# Altium schematic sheet S7CAS-PLEIADES-CARTE-MERE_P06_MOTOR.SCHDOC
size Tabloid; SheetNumber: 13; SheetTotal: 18; Sheet_Name: MOTOR; Size: 11x17
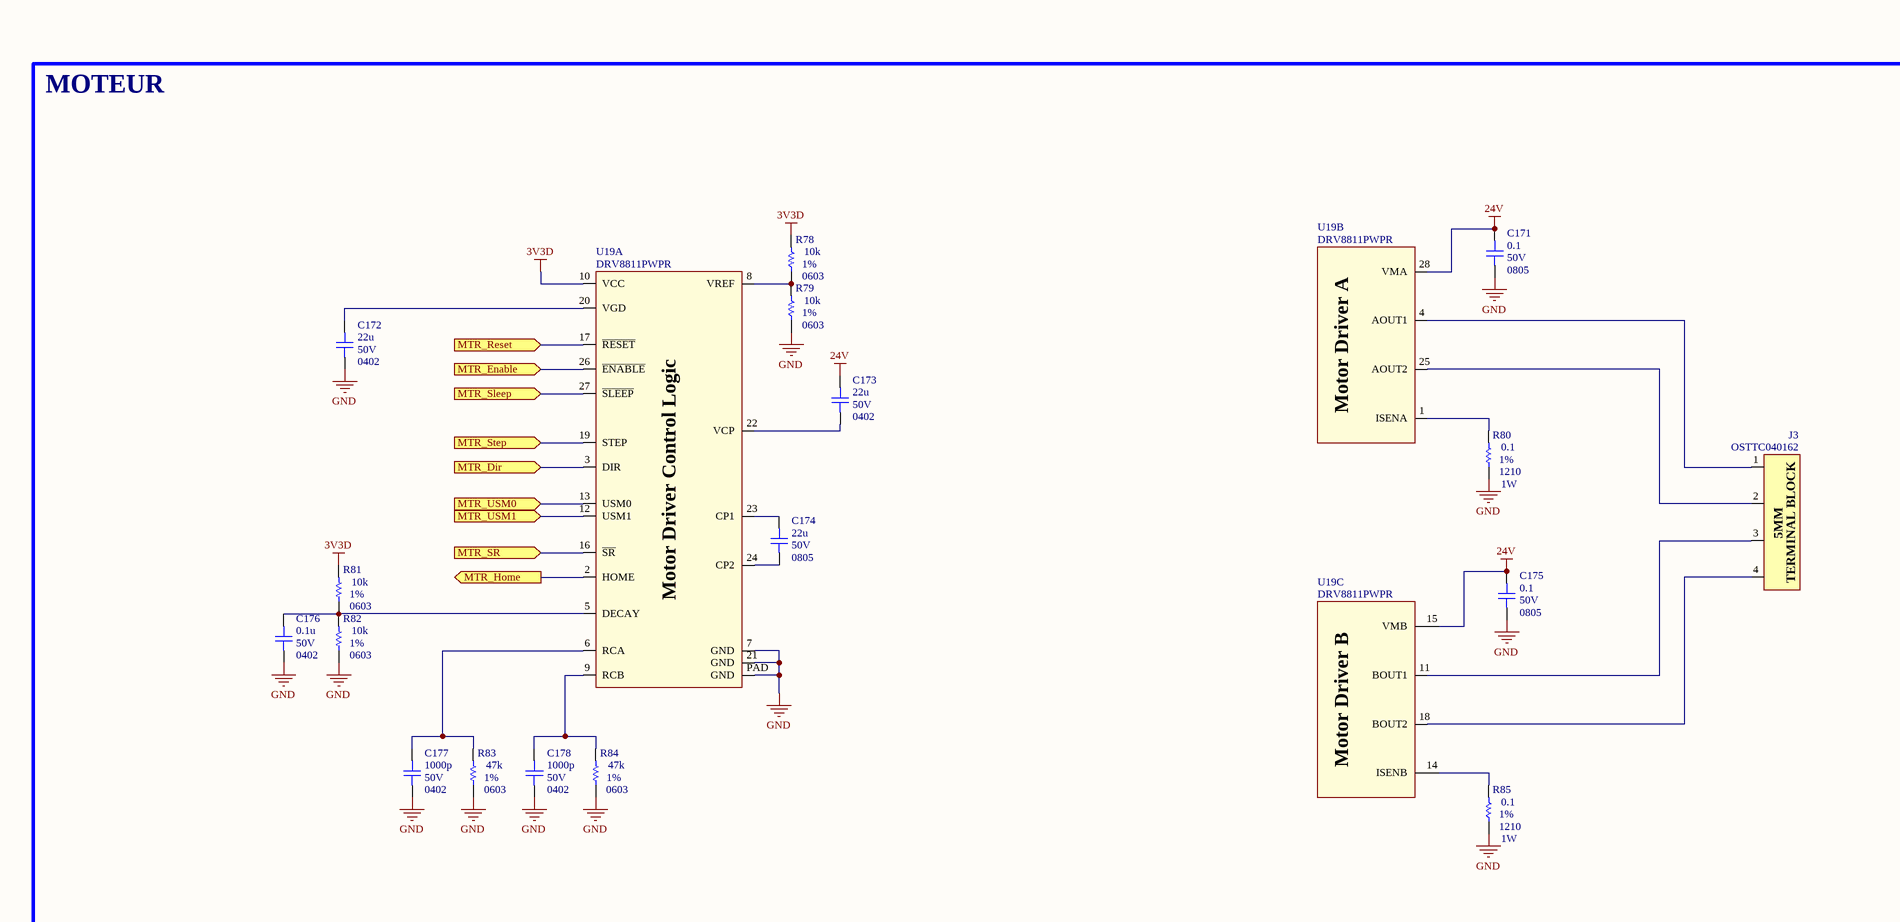
[diagram p0: S7CAS-PLEIADES-CARTE-MERE_P06_MOTOR.SCHDOC, top left]
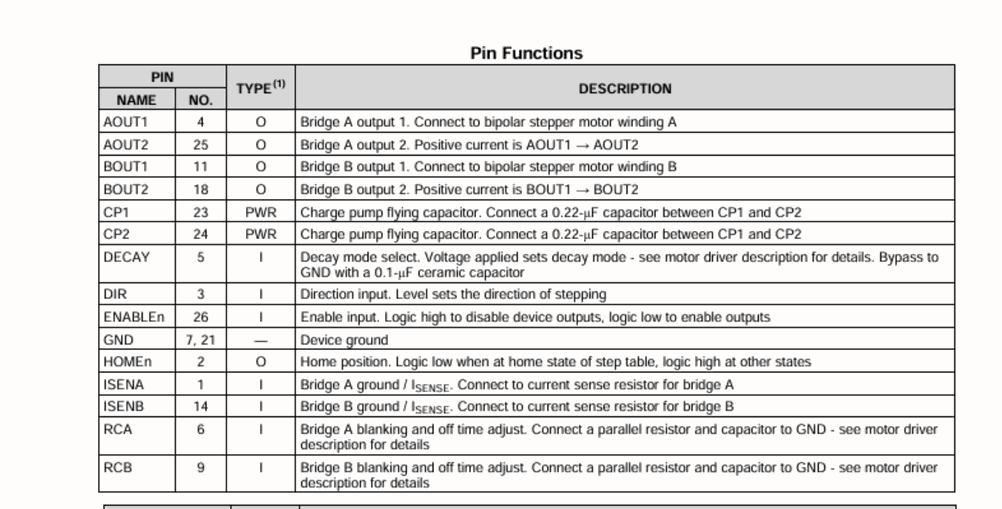
[diagram p1: S7CAS-PLEIADES-CARTE-MERE_P06_MOTOR.SCHDOC, top right]
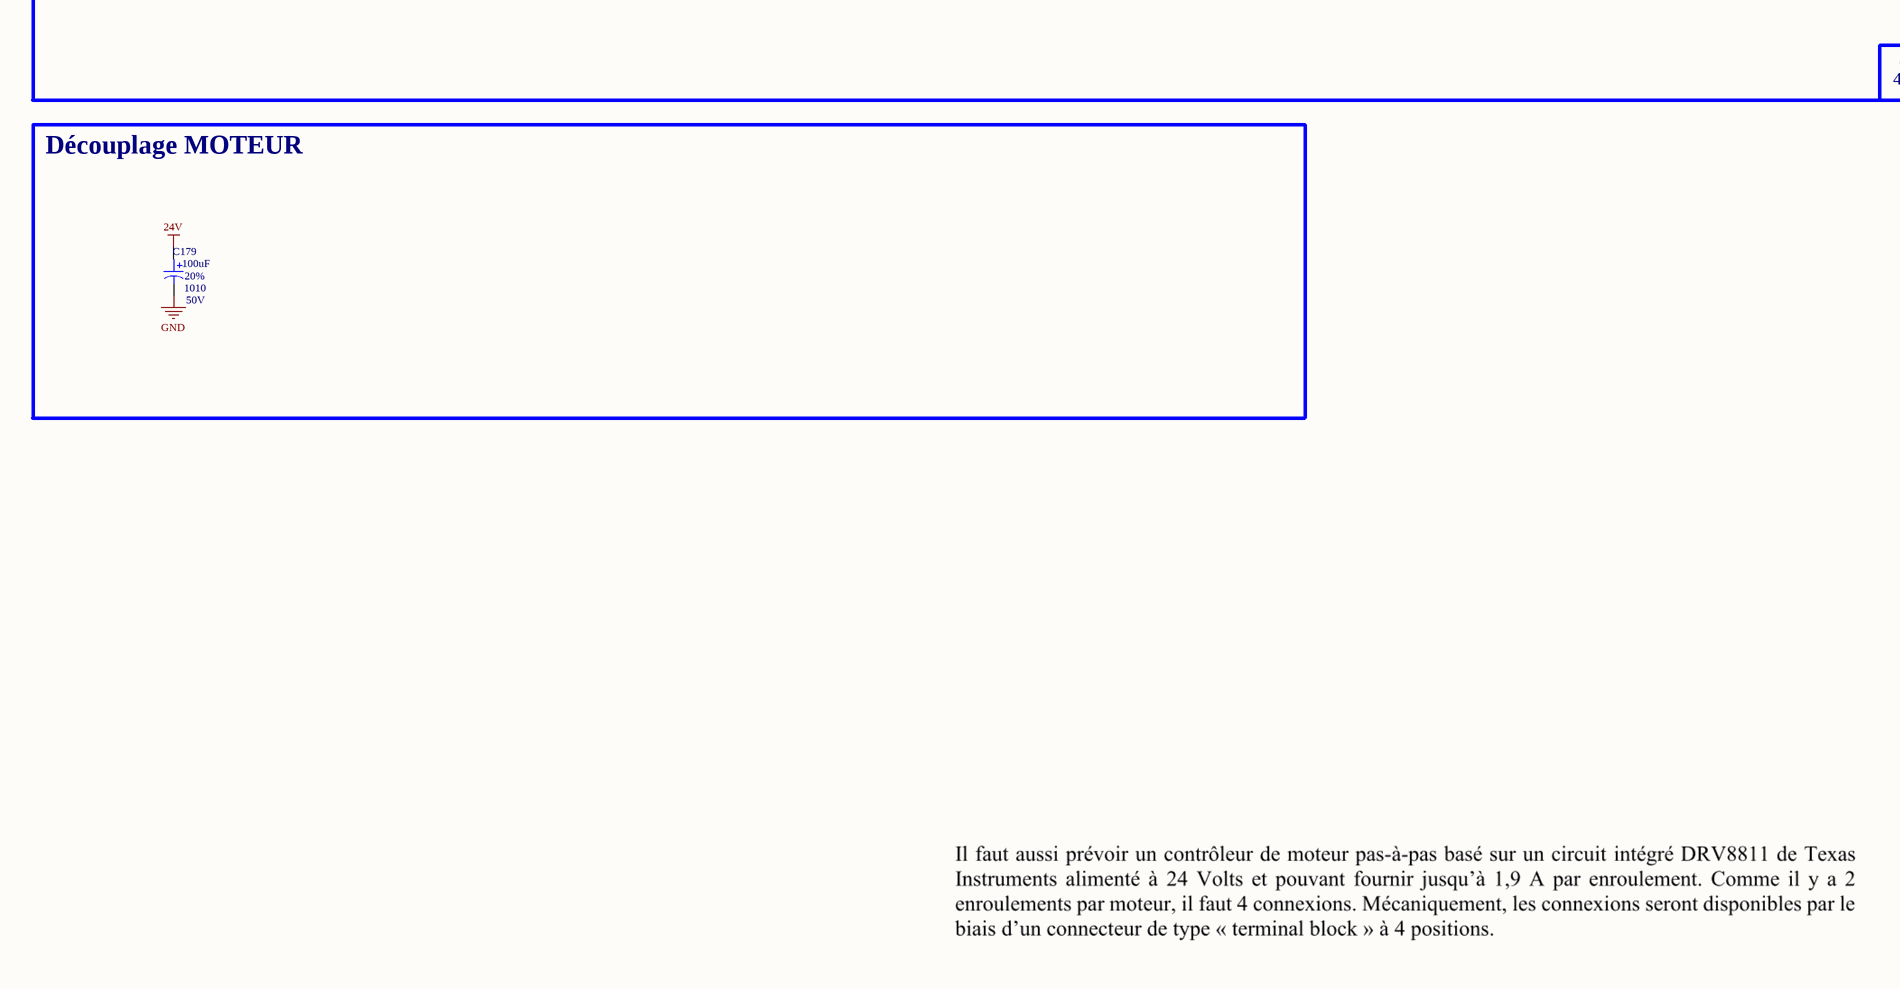
[diagram p2: S7CAS-PLEIADES-CARTE-MERE_P06_MOTOR.SCHDOC, bottom left]
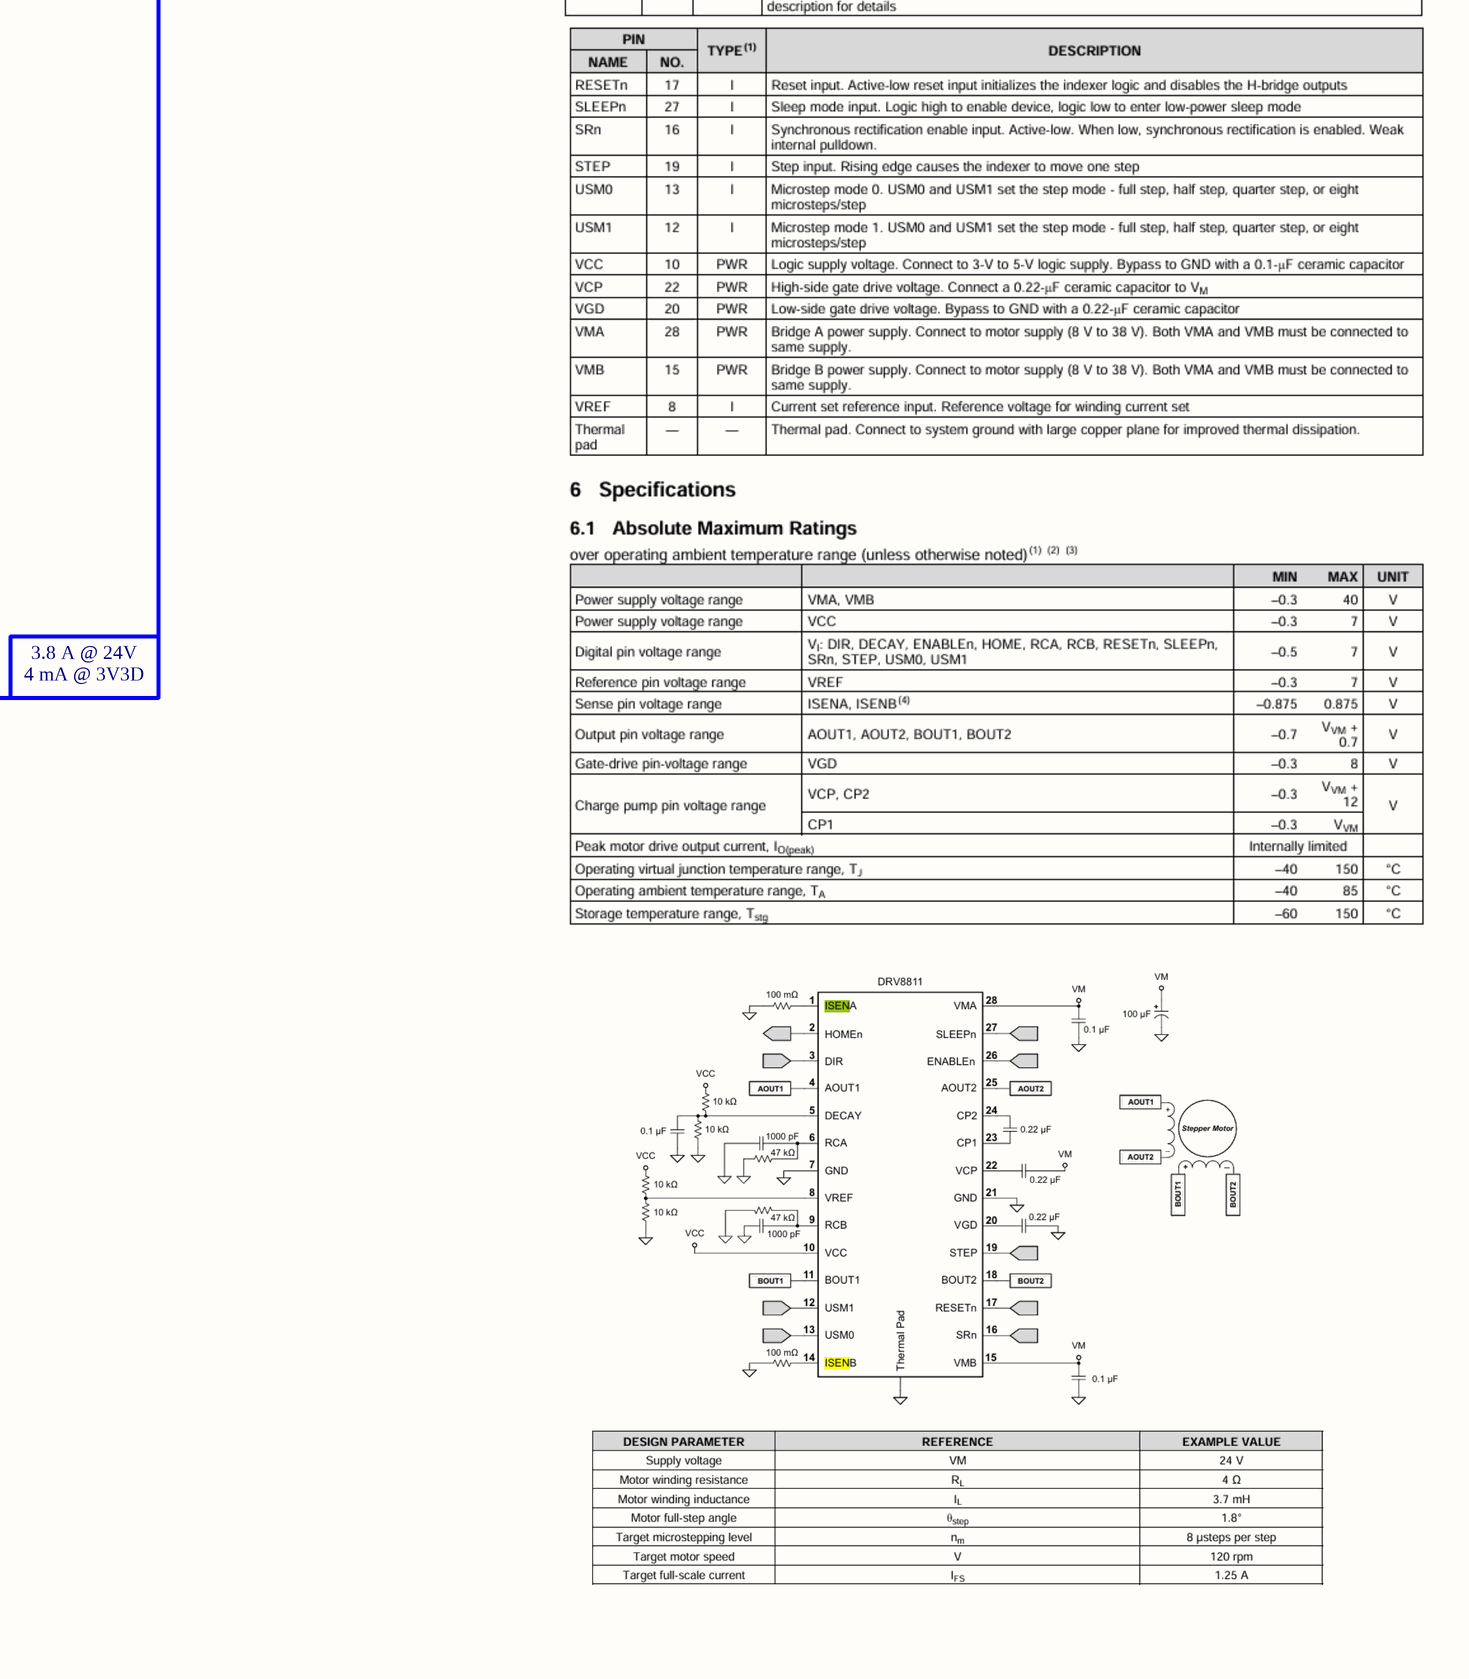
[diagram p3: S7CAS-PLEIADES-CARTE-MERE_P06_MOTOR.SCHDOC, bottom right]

## Parts
C171  value 0.1  Voltage: 50V  Package: 0805  [CAP_0805]  (hidden comment: CAP - 0805)
C172  value 22u  Voltage: 50V  Package: 0402  [CAP_0402]  (hidden comment: CAP - 0402)
C173  value 22u  Voltage: 50V  Package: 0402  [CAP_0402]  (hidden comment: CAP - 0402)
C174  value 22u  Voltage: 50V  Package: 0805  [CAP_0805]  (hidden comment: CAP - 0805)
C175  value 0.1  Voltage: 50V  Package: 0805  [CAP_0805]  (hidden comment: CAP - 0805)
C176  value 0.1u  Voltage: 50V  Package: 0402  [CAP_0402]  (hidden comment: CAP - 0402)
C177  value 1000p  Voltage: 50V  Package: 0402  [CAP_0402]  (hidden comment: CAP - 0402)
C178  value 1000p  Voltage: 50V  Package: 0402  [CAP_0402]  (hidden comment: CAP - 0402)
C179  value 100uF  Voltage: 50V  Package: 1010  Precision: 20%  [CAP_ALU_1010_vishay]  (hidden comment: MAL215099101E3)
J3  OSTTC040162  [CONN_TERMINAL_OSTTA040161]
R78  value 10k  Package: 0603  Precision: 1%  [RES_0603]  (hidden comment: RES - 0603)
R79  value 10k  Package: 0603  Precision: 1%  [RES_0603]  (hidden comment: RES - 0603)
R80  value 0.1  Power: 1W  Package: 1210  Precision: 1%  [RES_1210]  (hidden comment: RES - 1210)
R81  value 10k  Package: 0603  Precision: 1%  [RES_0603]  (hidden comment: RES - 0603)
R82  value 10k  Package: 0603  Precision: 1%  [RES_0603]  (hidden comment: RES - 0603)
R83  value 47k  Package: 0603  Precision: 1%  [RES_0603]  (hidden comment: RES - 0603)
R84  value 47k  Package: 0603  Precision: 1%  [RES_0603]  (hidden comment: RES - 0603)
R85  value 0.1  Power: 1W  Package: 1210  Precision: 1%  [RES_1210]  (hidden comment: RES - 1210)
U19  DRV8811PWPR  [POW_MOTOR_DRV8811PWPR]  (parts A,B,C of 3)

## Blocks framed on the sheet
MOTEUR: C171-C178 J3 R78-R85 U19
Découplage MOTEUR: C179

## Ports
MTR_Dir (in, see S7CAS-PLEIADES-CARTE-MERE_P06_FPGA1[3B]), MTR_Enable (in, see S7CAS-PLEIADES-CARTE-MERE_P06_FPGA1[3A]), MTR_Home (out, see S7CAS-PLEIADES-CARTE-MERE_P06_FPGA1[3B]), MTR_Reset (in, see S7CAS-PLEIADES-CARTE-MERE_P06_FPGA1[3A]), MTR_Sleep (in, see S7CAS-PLEIADES-CARTE-MERE_P06_FPGA1[3A]), MTR_SR (in, see S7CAS-PLEIADES-CARTE-MERE_P06_FPGA1[3B]), MTR_Step (in, see S7CAS-PLEIADES-CARTE-MERE_P06_FPGA1[3A]), MTR_USM0 (in, see S7CAS-PLEIADES-CARTE-MERE_P06_FPGA1[3B]), MTR_USM1 (in, see S7CAS-PLEIADES-CARTE-MERE_P06_FPGA1[3B])

## Nets
3V3D: R78.2 R81.2 U19.10(VCC)
24V: C171.2 C173.2 C175.2 C179.1 U19.15(VMB) U19.28(VMA)
GND: C171.1 C172.1 C175.1 C176.1 C177.1 C178.1 C179.2 R79.1 R80.1 R82.1 R83.1 R84.1 R85.1 U19.7(GND) U19.21(GND) U19.PAD(GND)
MTR_Dir: U19.3(DIR) ; port MTR_Dir
MTR_Enable: U19.26(~{ENABLE}) ; port MTR_Enable
MTR_Home: U19.2(HOME) ; port MTR_Home
MTR_Reset: U19.17(~{RESET}) ; port MTR_Reset
MTR_Sleep: U19.27(~{SLEEP}) ; port MTR_Sleep
MTR_SR: U19.16(~{SR}) ; port MTR_SR
MTR_Step: U19.19(STEP) ; port MTR_Step
MTR_USM0: U19.13(USM0) ; port MTR_USM0
MTR_USM1: U19.12(USM1) ; port MTR_USM1
NetC172_2: C172.2 U19.20(VGD)
NetC173_1: C173.1 U19.22(VCP)
NetC174_1: C174.1 U19.24(CP2)
NetC174_2: C174.2 U19.23(CP1)
NetC176_2: C176.2 R81.1 R82.2 U19.5(DECAY)
NetC177_2: C177.2 R83.2 U19.6(RCA)
NetC178_2: C178.2 R84.2 U19.9(RCB)
NetJ3_1: J3.1 U19.4(AOUT1)
NetJ3_2: J3.2 U19.25(AOUT2)
NetJ3_3: J3.3 U19.11(BOUT1)
NetJ3_4: J3.4 U19.18(BOUT2)
NetR78_1: R78.1 R79.2 U19.8(VREF)
NetR80_2: R80.2 U19.1(ISENA)
NetR85_2: R85.2 U19.14(ISENB)

## Notes on the sheet
- 3.8 A @ 24V
  4 mA @ 3V3D
- Sheet Name
- Project Title
- Global Project
- Size
- Group
- Revision
- Date
- Sheet
- of
- Filename
- Designers
- (in symbol CONN_TERMINAL_OSTTC040162) 5MM; TERMINAL BLOCK
- (in symbol POW_MOTOR_DRV8811PWPR, part A) Motor Driver Control Logic
- (in symbol POW_MOTOR_DRV8811PWPR, part B) Motor Driver A
- (in symbol POW_MOTOR_DRV8811PWPR, part C) Motor Driver B

## Library data of the parts
C171 C174 C175 = CAP - 0805: Precision: 10%; Current: *; CreatedBy: Jonathan Bouchard; Power: *
C172 C173 C176-C178 = CAP - 0402: Precision: 10%; Current: *; CreatedBy: Jonathan Bouchard; Power: *
C179 = CAP_ALU_MAL215099101E3: CAP - ALU 100uF 20% 50V - 1010; Current: 490mA; Mfg: Vishay Dale; Mfg Part Number: MAL215099101E3; HelpURL: http://www.vishay.com/docs/28395/150crz.pdf; CreatedBy: Jonathan Bouchard; Temperature: -55°C to 125°C; Power: *; Supplier 1: Digikey; Supplier Part Number 1: 4399PHDKR-ND
J3 = CONN_TERMINAL_OSTTC040162: CONN -  TERMINAL BLOCK 4POS 5MM - TH; Mfg: On Shore Technology Inc.; Voltage: *; Current: *; Power: *; Mfg Part Number: OSTTC040162; HelpURL: http://www.on-shore.com/wp-content/uploads/2015/09/osttcxx0162.pdf; CreatedBy: Jonathan Bouchard; Temperature: -30°C ~ 105°C; Value: *; Precision: *; Package: TH-4; Supplier 1: Digikey; Supplier Part Number 1: ED2602-ND
U19 = POW_MOTOR_DRV8811PWPR: POW - STEPPER MOTOR DRIVER - SOP-28; Voltage: 3 V ~ 5.5 V / 8 V ~ 38 V; Mfg: Texas Instrument; Current: *; Power: *; Mfg Part Number: DRV8811PWPR; HelpURL: http://www.ti.com/lit/ds/symlink/drv8811.pdf; CreatedBy: Jonathan Bouchard; Temperature: -40°C ~ 150°C (TJ); Value: *; Precision: *; Package: SOP-28; Supplier 1: Digikey; Supplier Part Number 1: 296-24591-1-ND
R78 R79 R81-R84 = RES - 0603: Current: *; CreatedBy: Jonathan Bouchard
R80 R85 = RES - 1210: Current: *; CreatedBy: Jonathan Bouchard